# EAGLE design BleepDrum (EAGLE 6.4)
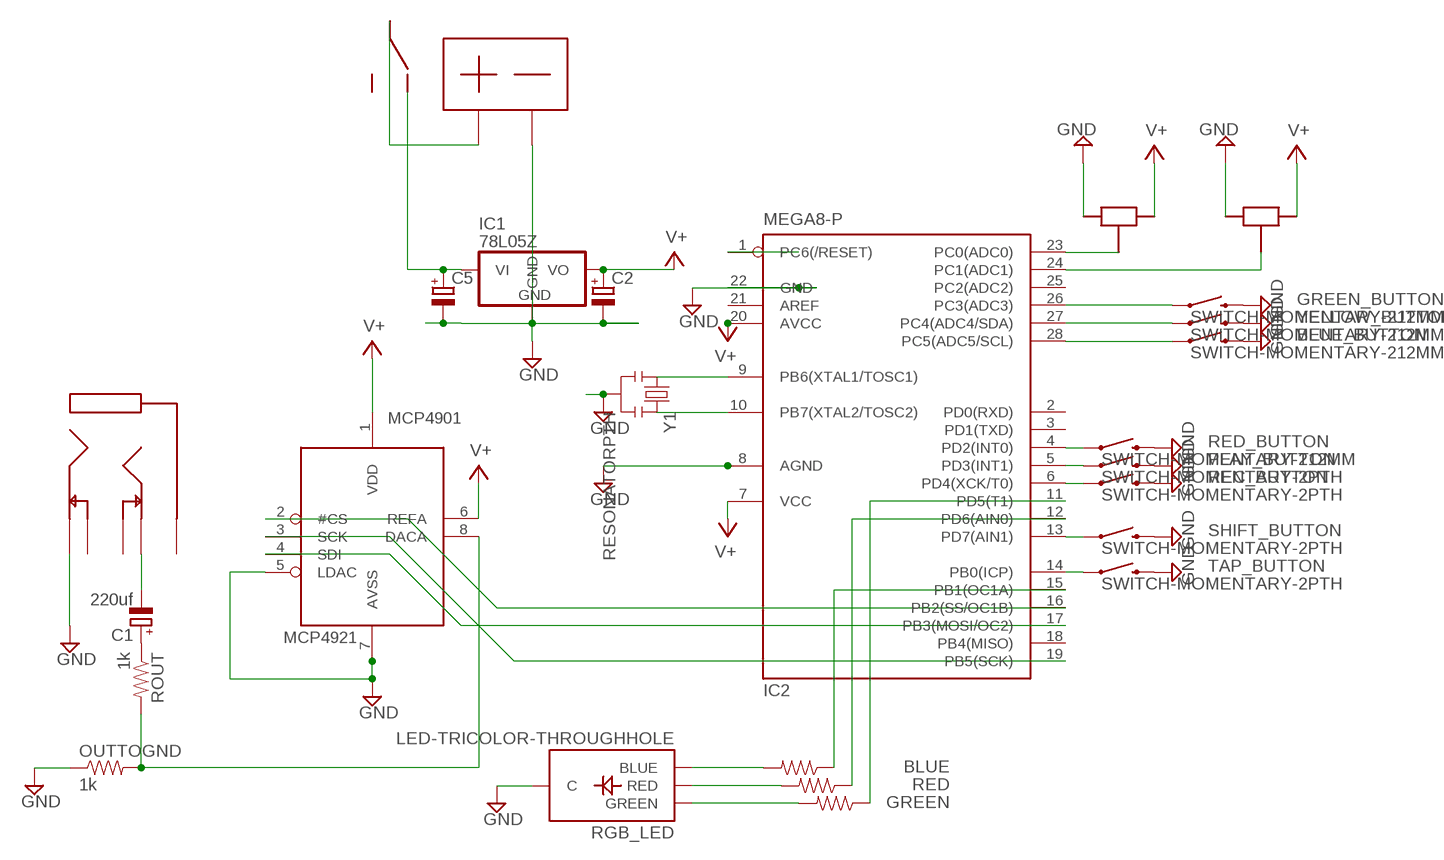
[diagram p0: schematic, sheet 1]

## Parts
BLUE  RESISTORPTH-1/6W  [1/6W-RES]
BLUE_BUTTON  SWITCH-MOMENTARY-212MM  [TACTILE-PTH-12MM]
C1  220uf  CPOL-EUE2.5-6  [E2,5-6]
C2  CPOL-EUE2.5-6  [E2,5-6]
C5  CPOL-EUE2.5-6  [E2,5-6]
GREEN  RESISTORPTH-1/6W  [1/6W-RES]
GREEN_BUTTON  SWITCH-MOMENTARY-212MM  [TACTILE-PTH-12MM]
IC1  78L05Z  [TO92]
IC2  MEGA8-P  [DIL28-3]
LEFT_POT  POT  [POT]
MCP4901  MCP4921  [DIL08]
OUTTOGND  1k  RESISTORPTH-1/6W  [1/6W-RES]
PLAY_BUTTON  SWITCH-MOMENTARY-2PTH  [TACTILE-PTH]
REC_BUTTON  SWITCH-MOMENTARY-2PTH  [TACTILE-PTH]
RED  RESISTORPTH-1/6W  [1/6W-RES]
RED_BUTTON  SWITCH-MOMENTARY-212MM  [TACTILE-PTH-12MM]
RGB_LED  LED-TRICOLOR-THROUGHHOLE  [LED-TRICOLOR-THROUGHHOLE]
RIGHT_POT  POT  [POT]
ROUT  1k  RESISTORPTH-1/6W  [1/6W-RES]
SHIFT_BUTTON  SWITCH-MOMENTARY-2PTH  [TACTILE-PTH]
SW1  SLIDE_HORIZ_OS  [SLIDE_HORIZ_OS]
TAP_BUTTON  SWITCH-MOMENTARY-2PTH  [TACTILE-PTH]
U$7  9VSMALPINS  [9VSMALLPINS]
U$8  1/8STEREO  [1/8STEREO]
Y1  RESONATORPTH  [RESONATOR-PTH]
YELLOW_BUTTON  SWITCH-MOMENTARY-212MM  [TACTILE-PTH-12MM]

## Nets
GND: BLUE_BUTTON.3 C2.- C5.- GREEN_BUTTON.3 IC1.2(GND) IC2.8(AGND) IC2.22(GND) LEFT_POT.P$3 MCP4901.5(LDAC) MCP4901.7(AVSS) OUTTOGND.1 PLAY_BUTTON.3 REC_BUTTON.3 RED_BUTTON.3 RGB_LED.GND(C) RIGHT_POT.P$3 SHIFT_BUTTON.3 TAP_BUTTON.3 U$7.P$2 U$8.P$2 Y1.2 YELLOW_BUTTON.3
N$1: IC2.10(PB7(XTAL2/TOSC2)) Y1.3
N$2: BLUE.1 IC2.15(PB1(OC1A))
N$3: IC2.12(PD6(AIN0)) RED.1
N$4: GREEN.1 IC2.11(PD5(T1))
N$5: IC2.1(PC6(/RESET))
N$6: IC2.9(PB6(XTAL1/TOSC1)) Y1.1
N$7: IC2.17(PB3(MOSI/OC2)) MCP4901.4(SDI)
N$8: SW1.P$1 U$7.P$1
N$9: IC2.19(PB5(SCK)) MCP4901.3(SCK)
N$10: IC2.23(PC0(ADC0)) RIGHT_POT.P$2
N$11: IC2.24(PC1(ADC1)) LEFT_POT.P$2
N$12: C1.+ ROUT.1
N$13: MCP4901.8(DACA) OUTTOGND.2 ROUT.2
N$14: BLUE.2 RGB_LED.GRN(BLUE)
N$15: RED.2 RGB_LED.BLU(RED)
N$16: GREEN.2 RGB_LED.RED(GREEN)
N$17: IC2.5(PD3(INT1)) PLAY_BUTTON.1
N$18: C1.- U$8.P$5
N$19: IC2.27(PC4(ADC4/SDA)) YELLOW_BUTTON.1
N$22: C5.+ IC1.3(VI) SW1.P$2
N$23: C2.+ IC1.1(VO) IC2.7(VCC) IC2.20(AVCC) LEFT_POT.P$1 MCP4901.1(VDD) MCP4901.6(REFA) RIGHT_POT.P$1 ; supply symbol labelled V+
N$28: IC2.14(PB0(ICP)) TAP_BUTTON.1
N$29: IC2.6(PD4(XCK/T0)) REC_BUTTON.1
N$31: IC2.13(PD7(AIN1)) SHIFT_BUTTON.1
N$33: GREEN_BUTTON.1 IC2.26(PC3(ADC3))
N$34: BLUE_BUTTON.1 IC2.28(PC5(ADC5/SCL))
N$37: IC2.16(PB2(SS/OC1B)) MCP4901.2(#CS)
P1: IC2.4(PD2(INT0)) RED_BUTTON.1
Unconnected: IC2.2(PD0(RXD)) IC2.3(PD1(TXD)) IC2.18(PB4(MISO)) IC2.21(AREF) IC2.25(PC2(ADC2)) SW1.P$3 U$8.P$1 U$8.P$3 U$8.P$4

## Library data of the parts
BLUE GREEN OUTTOGND RED ROUT = SparkFun-Passives:RESISTOR: Resistor Basic schematic elements and footprints for 0603, 1206, and PTH resistors.
BLUE_BUTTON GREEN_BUTTON PLAY_BUTTON REC_BUTTON RED_BUTTON SHIFT_BUTTON TAP_BUTTON YELLOW_BUTTON = SparkFun-Electromechanical:SWITCH-MOMENTARY-2: Various NO switches- pushbuttons, reed, etc
C1 C2 C5 = rcl:CPOL-EU: POLARIZED CAPACITOR, European symbol
IC1 = linear:78*: Positive VOLTAGE REGULATOR Source: http://cache.national.com/ds/LM/LM78L05.pdf http://www.fairchildsemi.com/ds/LM/LM7805.pdf
IC2 = atmel:MEGA8-P: MICROCONTROLLER 8 Kbytes FLASH, 1 kbytes SRAM, 512 bytes EEPROM, USART, 4-channel 10 bit ADC, 2-channel 8 bit ADC Pin compatible with Atmega48, ATMega88, ATMega168 Source: avr.lbr; OC_FARNELL: unknown; OC_NEWARK: unknown
LEFT_POT RIGHT_POT = BLEEP:POT
MCP4901 = adafruit:MCP4921
RGB_LED = SparkFun:LED-TRICOLOR-THROUGHHOLE
SW1 = BLEEP:SLIDE_HORIZ_OS
U$7 = bleep t2:9VSMALPINS
U$8 = bleep t2:1/8STEREO
Y1 = SparkFun:RESONATOR: Resonator Small SMD resonator. This is the itty bitty 10/20MHz resonators with built in caps. CSTCE10M0G55 and CSTCE20M0V53. Footprint has been reviewed closely but hasn't been tested yet.

## Board
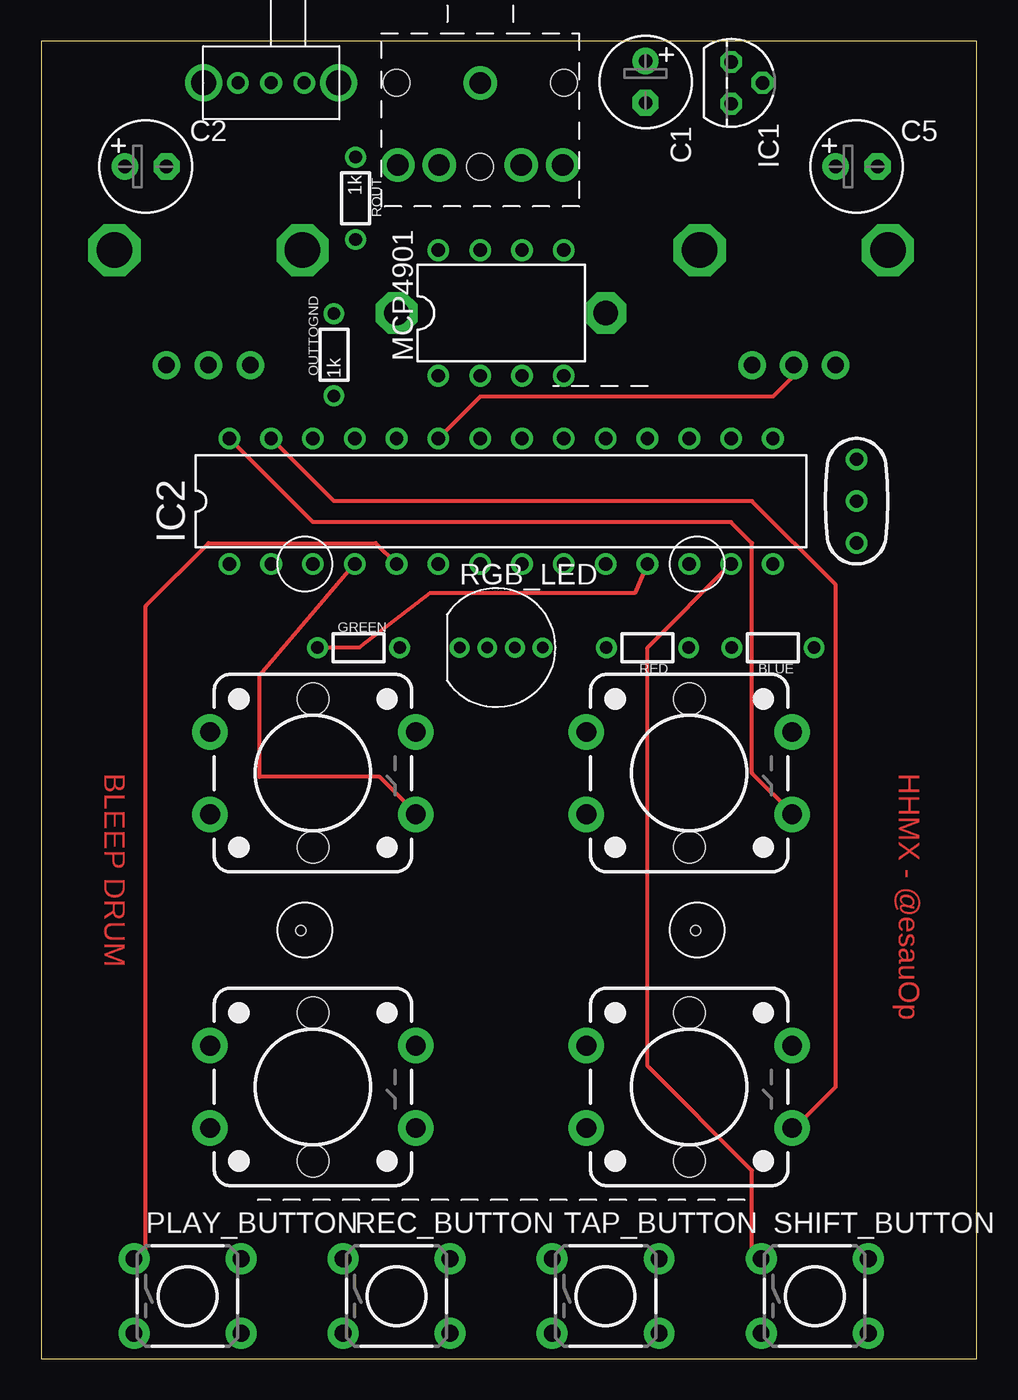
[diagram p1: board, top side]
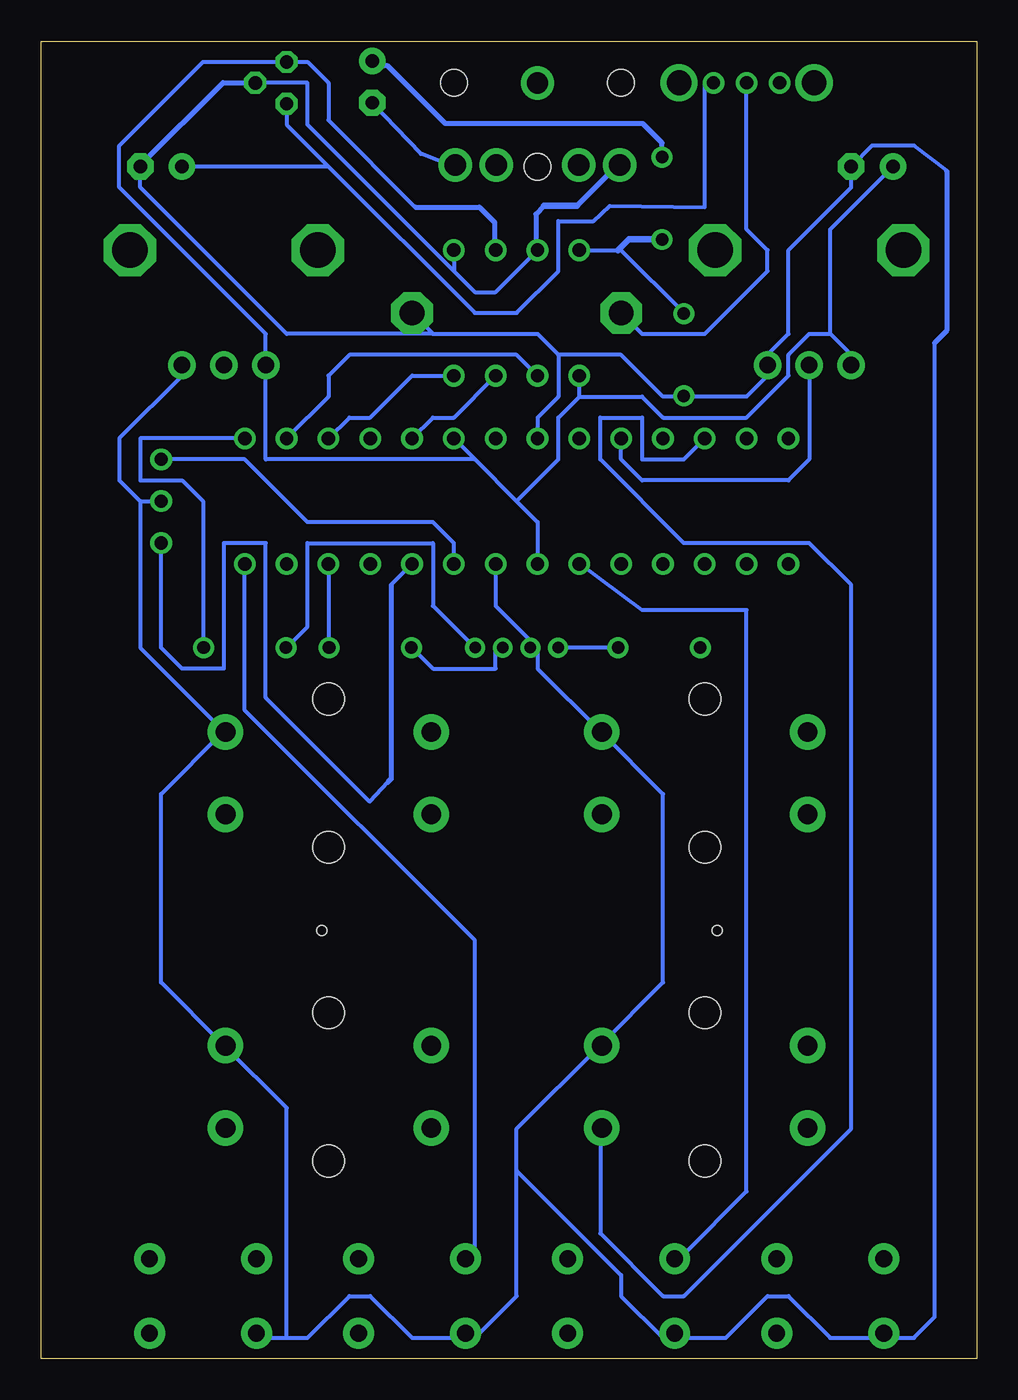
[diagram p2: board, bottom side, seen from below]

Size 56.82 x 80 mm. Coordinates in mm from the lower left corner, seen from the top.
Outline: 0,0 56.82,0 56.82,80 0,80 0,0
Copper layers (1*16): Top 0.035mm / dielectric 1.5mm / Bottom 0.035mm
Design rules "default": minimum track width 10mil, minimum drill 24mil, track to track 8mil, track to pad 8mil, pad to pad 8mil, via to via 8mil, smd to smd 8mil, copper to edge 40mil, drill to drill 8mil, minimum pad ring 10mil, minimum via ring 8mil, stop-mask expansion 4mil, vias tented up to drill 0mil, thermal gap 10mil
Holes 0.6 mm at 15.77,26 39.77,26
Holes 0.9 mm at -5.08,80.01 -7.62,0 62.23,0 60.96,80.01

### Footprints (pad centres in the part's own frame; a part is rotated, then mirrored left to right if it is on the bottom)
1/6W-RES = drill 0.762: 1 -2.5,0; 2 2.5,0
TACTILE-PTH-12MM = drill 1.2 pad 2.159: 1 6.25,-2.5; 2 -6.25,-2.5; 3 6.25,2.5; 4 -6.25,2.5 | hole 1.905: 0,4.5; 0,-4.5
E2,5-6 = drill 0.813 pad 1.6: + -1.27,0 | drill 0.813 pad 1.6 octagon: - 1.27,0
TO92 = drill 0.813 octagon: 1 -1.27,0; 2 0,1.905; 3 1.27,0
DIL28-3 = drill 0.813: 1 -16.51,-3.81; 2 -13.97,-3.81; 3 -11.43,-3.81; 4 -8.89,-3.81; 5 -6.35,-3.81; 6 -3.81,-3.81; 7 -1.27,-3.81; 8 1.27,-3.81; 9 3.81,-3.81; 10 6.35,-3.81; 11 8.89,-3.81; 12 11.43,-3.81; 13 13.97,-3.81; 14 16.51,-3.81; 15 16.51,3.81; 16 13.97,3.81; 17 11.43,3.81; 18 8.89,3.81; 19 6.35,3.81; 20 3.81,3.81; 21 1.27,3.81; 22 -1.27,3.81; 23 -3.81,3.81; 24 -6.35,3.81; 25 -8.89,3.81; 26 -11.43,3.81; 27 -13.97,3.81; 28 -16.51,3.81
POT = drill 1 pad 1.676: P$1 -2.54,-6.985; P$2 0,-6.985; P$3 2.54,-6.985 | drill 2.159 octagon: P$7 -5.715,0; P$8 5.715,0
DIL08 = drill 0.813: 1 -3.81,-3.81; 2 -1.27,-3.81; 3 1.27,-3.81; 4 3.81,-3.81; 5 3.81,3.81; 6 1.27,3.81; 7 -1.27,3.81; 8 -3.81,3.81
TACTILE-PTH = drill 1.016 pad 1.88: 1 -3.251,2.261; 2 3.251,2.261; 3 -3.251,-2.261; 4 3.251,-2.261
LED-TRICOLOR-THROUGHHOLE = drill 0.7: BLU 0.841,0; GND -0.841,0; GRN 2.524,0; RED -2.524,0
SLIDE_HORIZ_OS = drill 0.8: P$1 0,0; P$2 2.007,0; P$3 -2.007,0 | drill 1.5 pad 2.032: P$4 4.102,0; P$5 -4.102,0
9VSMALLPINS = drill 1.5 pad 2.54 octagon: P$1 0,-6.35; P$2 0,6.35
1/8STEREO = drill 1.3 pad 2.032: P$1 0,0; P$2 5,-5; P$3 5,-2.5; P$4 5,2.5; P$5 5,5 | hole 1.6: 0,5.08; 5.08,0; 0,-5.08
RESONATOR-PTH = drill 0.8 pad 1.27: 1 -2.54,0; 2 0,0; 3 2.54,0

### Placement (x,y rotation side)
BLUE  44.45,43.18 180 top
BLUE_BUTTON  39.37,35.56 0 top
C1  36.71,77.53 270 top
C2  6.35,72.39 0 top
C5  49.53,72.39 0 top
GREEN  19.28,43.18 0 top
GREEN_BUTTON  16.51,16.51 0 top
IC1  41.91,77.47 270 top
IC2  27.94,52.07 0 top
LEFT_POT  10.16,67.31 0 top
MCP4901  27.94,63.5 0 top
OUTTOGND  17.78,60.96 90 top
PLAY_BUTTON  8.89,3.81 0 top
REC_BUTTON  21.59,3.81 0 top
RED  36.83,43.18 180 top
RED_BUTTON  16.51,35.56 0 top
RGB_LED  27.94,43.18 0 top
RIGHT_POT  45.72,67.31 0 top
ROUT  19.1,70.46 270 top
SHIFT_BUTTON  46.99,3.81 0 top
SW1  13.97,77.47 0 top
TAP_BUTTON  34.29,3.81 0 top
U$7  27.94,63.5 270 top
U$8  26.67,77.47 270 top
Y1  49.53,52.07 270 top
YELLOW_BUTTON  39.37,16.51 0 top

### Tracks (layer width: path | path; a pad name or v marks a point on that pad's centre or on a via)
GND
  Bottom 0.254: MCP4901.7 29.21,64.77 30.48,64.77 31.75,66.04 | MCP4901.5 31.75,66.04 | IC1.2 40.64,77.47 40.64,74.93 31.75,66.04 | IC2.22 26.67,57.15 25.4,58.42 25.4,60.96 | 25.4,60.96 26.67,62.23 33.02,62.23 | U$7.P$2 33.02,62.23 | 17.78,58.42 13.97,58.42 12.7,59.69 LEFT_POT.P$3 12.7,60.96 11.43,62.23 11.43,67.31 7.62,71.12 C2.- 6.35,73.66 3.81,73.66 1.81,72.12 | 25.4,60.96 21.59,60.96 19.05,58.42 17.78,58.42 | 17.78,58.42 OUTTOGND.1 | 33.02,62.23 41.91,62.23 50.8,71.12 C5.- 50.77,72.5 | 50.8,52.07 Y1.2 | 50.8,52.07 52.07,53.34 52.07,55.88 48.26,59.69 RIGHT_POT.P$3 | 45.72,38.1 50.8,43.18 50.8,52.07 | 26.67,43.18 29.21,45.72 IC2.8 | 22.86,38.1 26.67,41.91 26.67,43.18 | 26.67,43.18 RGB_LED.GND | 41.91,1.27 43.18,1.27 SHIFT_BUTTON.3 | 41.91,1.27 40.64,1.27 38.1,3.81 36.83,3.81 34.29,1.27 31.75,1.27 TAP_BUTTON.3 30.48,1.27 27.94,3.81 27.94,11.43 | 22.86,19.05 27.94,13.97 27.94,11.43 | 45.72,19.05 41.91,15.24 41.91,1.27 | 27.94,11.43 21.59,5.08 21.59,3.81 19.05,1.27 REC_BUTTON.3 17.78,1.27 15.24,1.27 12.7,3.81 11.43,3.81 8.89,1.27 6.35,1.27 PLAY_BUTTON.3 5.08,1.27 3.81,1.27 2.54,2.54 2.54,61.69 | 22.86,38.1 19.05,34.29 19.05,22.86 22.86,19.05 | 22.86,38.1 RED_BUTTON.3 | 22.86,19.05 GREEN_BUTTON.3 | 45.72,38.1 49.53,34.29 49.53,22.86 45.72,19.05 | 45.72,38.1 BLUE_BUTTON.3 | 45.72,19.05 YELLOW_BUTTON.3
  Bottom 0.305: 21.8,72.47 24.27,70 | 26.27,70 26.77,69.5 26.77,67.41 | 50.77,72.5 45.77,77.48 IC1.2 | 1.81,72.12 1.81,62.42 2.54,61.69
  Bottom 0.406: U$8.P$2 21.8,72.47 | 24.27,70 26.27,70 | 26.77,67.41 MCP4901.7
N$1
  Bottom 0.254: Y1.3 49.53,43.18 48.26,41.91 45.72,41.91 45.72,49.53 43.18,49.53 43.18,40.14 36.87,33.83 35.77,35 | IC2.10 35.56,46.99
  Bottom 0.305: 35.56,46.99 35.56,35.21 35.77,35
N$2
  Bottom 0.254: IC2.15 50.8,55.88 50.8,53.34 48.26,53.34 46.99,52.07 46.99,43.18 BLUE.1
N$3
  Bottom 0.254: IC2.12 39.37,43.18 RED.1
N$4
  Top 0.254: IC2.11 36.06,46.49 23.63,46.49 19.32,43.18 GREEN.1 16.51,43.18
N$6
  Bottom 0.254: Y1.1 44.45,54.61 40.64,50.8 33.02,50.8 31.75,49.53 IC2.9
N$7
  Bottom 0.254: MCP4901.4 34.29,59.69 36.83,57.15 38.1,57.15 IC2.17
N$8
  Bottom 0.254: SW1.P$1 13.97,68.58 12.7,67.31 12.7,66.04 16.51,62.23 20.32,62.23 U$7.P$1
N$9
  Bottom 0.254: MCP4901.3 31.75,57.15 33.02,57.15 IC2.19
N$10
  Top 0.254: IC2.23 26.67,58.42 44.45,58.42 45.72,59.69 RIGHT_POT.P$2
N$11
  Bottom 0.254: IC2.24 21.59,54.61 20.32,53.34 11.43,53.34 10.16,54.61 LEFT_POT.P$2
N$12
  Bottom 0.305: ROUT.1 19.1,73.83 20.27,75 32.27,75 35.77,78.5 36.41,78.5 C1.+
N$13
  Bottom 0.254: MCP4901.8 21.77,67.31 21.59,67.31 17.78,63.5 OUTTOGND.2
  Bottom 0.406: ROUT.2 21.12,67.96 21.77,67.31
N$14
  Bottom 0.254: RGB_LED.GRN 30.48,43.18 33.02,45.72 33.02,49.53 40.64,49.53 40.64,44.45 41.91,43.18 BLUE.2
N$15
  Bottom 0.254: RGB_LED.BLU 29.21,43.18 29.21,41.91 33.02,41.91 34.29,43.18 RED.2
N$16
  Bottom 0.254: GREEN.2 RGB_LED.RED
N$17
  Top 0.254: IC2.5 20.32,49.53 10.16,49.53 6.35,45.72 6.35,6.35 PLAY_BUTTON.1
N$18
  Bottom 0.254: C1.- 33.75,73.16 31.75,72.39 U$8.P$5
N$19
  Top 0.254: IC2.27 17.78,52.07 43.18,52.07 48.26,46.99 48.26,16.51 45.72,13.97 YELLOW_BUTTON.1
N$22
  Bottom 0.254: 39.37,72.39 41.91,74.93 IC1.3 | 39.37,72.39 30.48,63.5 27.94,63.5 25.4,66.04 25.4,69.08 23.27,69.08 22.27,70 16.51,69.93 16.51,77.47 SW1.P$2 | 39.37,72.39 C5.+
N$23
  Bottom 0.254: 34.1,69.93 39.37,75.2 39.37,77.47 40.64,78.74 IC1.1 46.99,78.74 52.07,73.66 52.07,71.12 43.18,62.23 RIGHT_POT.P$1 43.18,54.61 30.48,54.61 | C2.+ 8.89,68.58 8.89,62.23 | 8.89,62.23 7.62,60.96 LEFT_POT.P$1 | IC2.7 26.67,50.8 27.94,52.07 | IC2.20 30.48,54.61 | 30.48,54.61 27.94,52.07 | 24.13,58.42 MCP4901.1 | 24.13,58.42 25.4,57.15 25.4,54.61 27.94,52.07 | 8.89,62.23 10.16,62.23 11.43,60.96 11.43,59.69 13.97,57.15 19.05,57.15 20.32,58.42 24.13,58.42
  Bottom 0.305: 34.1,69.93 30.2,69.93 29.27,69 29.27,67.37 MCP4901.6
N$28
  Bottom 0.254: IC2.14 44.45,39.37 30.48,25.4 30.48,6.35 TAP_BUTTON.1
N$29
  Bottom 0.254: IC2.6 20.32,45.45 13.97,45.45 13.97,10.16 17.78,6.35 REC_BUTTON.1
N$31
  Top 0.254: IC2.13 36.83,43.18 36.83,17.78 43.18,11.43 43.18,6.35 SHIFT_BUTTON.1
N$33
  Bottom 0.254: IC2.26 17.78,54.61 20.32,54.61 20.32,57.15 22.86,57.15 22.86,54.61 17.78,49.53 10.16,49.53 7.62,46.99 7.62,13.97 17.78,3.81 19.05,3.81 22.86,7.62 22.86,13.97 GREEN_BUTTON.1
N$34
  Top 0.254: IC2.28 16.51,50.8 41.91,50.8 43.18,49.53 43.18,35.56 45.72,33.02 BLUE_BUTTON.1
N$37
  Bottom 0.254: IC2.16 39.37,58.42 39.37,59.69 38.1,60.96 27.94,60.96 MCP4901.2
P1
  Top 0.254: IC2.4 13.27,41.5 13.27,35.33 20.55,35.33 22.86,33.02 RED_BUTTON.1

### Text on the board
Top: BLEEP DRUM | HHMX - @esauOp